# Altium schematic sheet Sensors.SchDoc
size 420 x 297 mm; SheetNumber: 3; SheetTotal: 4
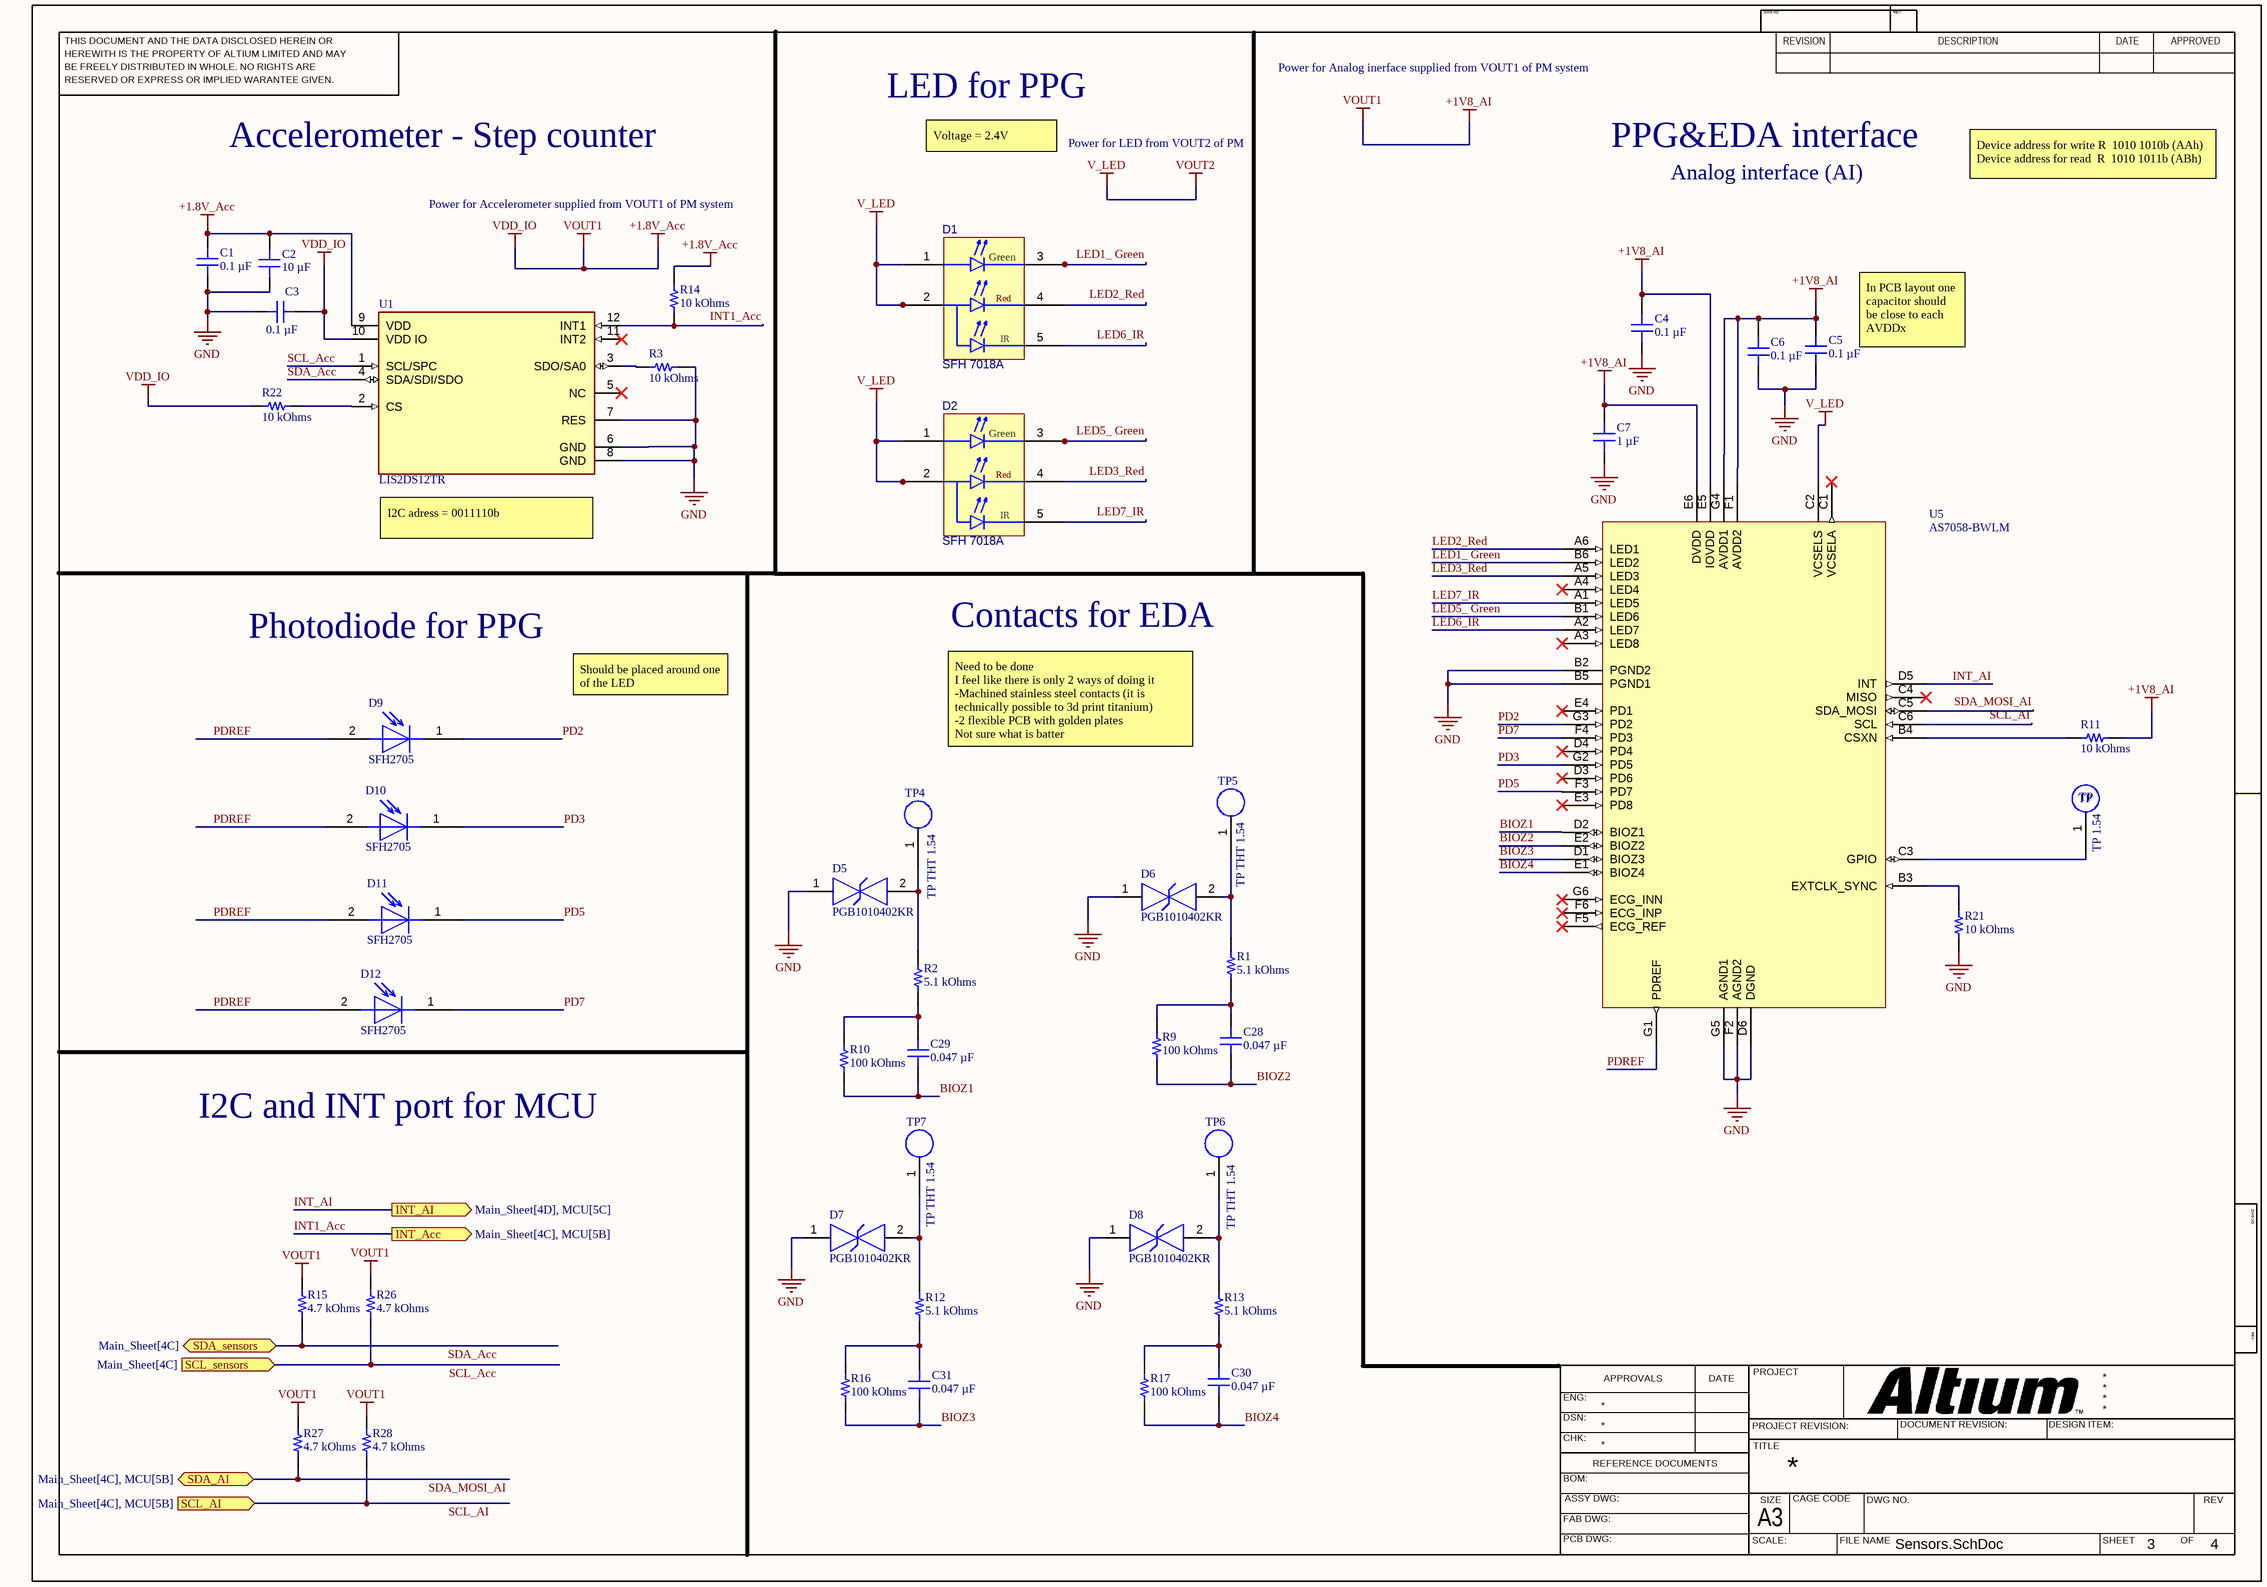
[diagram p0: Sensors.SchDoc]

## Parts
C1  0.1 µF  [CAP 0402_1005]
C2  10 µF  [CAP 0402_1005]
C3  0.1 µF  [CAP 0402_1005]
C4  0.1 µF  [CAP 0402_1005]
C5  0.1 µF  [CAP 0402_1005]
C6  0.1 µF  [CAP 0402_1005]
C7  1 µF  [CAP 0402_1005]
C28  0.047 µF  [CAP 0402_1005]
C29  0.047 µF  [CAP 0402_1005]
C30  0.047 µF  [CAP 0402_1005]
C31  0.047 µF  [CAP 0402_1005]
D1  SFH 7018A  [SFH 7018A-Footprint-1]
D2  SFH 7018A  [SFH 7018A-Footprint-1]
D5  PGB1010402KR  [FP-PGB1-0402-MFG]
D6  PGB1010402KR  [FP-PGB1-0402-MFG]
D7  PGB1010402KR  [FP-PGB1-0402-MFG]
D8  PGB1010402KR  [FP-PGB1-0402-MFG]
D9  SFH2705  [DFN175P215X60-2N]
D10  SFH2705  [DFN175P215X60-2N]
D11  SFH2705  [DFN175P215X60-2N]
D12  SFH2705  [DFN175P215X60-2N]
R1  5.1 kOhms  [RES 0402_1005]
R2  5.1 kOhms  [RES 0402_1005]
R3  10 kOhms  [RES 0402_1005]
R9  100 kOhms  [YAGEO RES 0402_1005]
R10  100 kOhms  [YAGEO RES 0402_1005]
R11  10 kOhms  [RES 0402_1005]
R12  5.1 kOhms  [RES 0402_1005]
R13  5.1 kOhms  [RES 0402_1005]
R14  10 kOhms  [RES 0402_1005]
R15  4.7 kOhms  [YAGEO RES 0402_1005]
R16  100 kOhms  [YAGEO RES 0402_1005]
R17  100 kOhms  [YAGEO RES 0402_1005]
R21  10 kOhms  [RES 0402_1005]
R22  10 kOhms  [RES 0402_1005]
R26  4.7 kOhms  [YAGEO RES 0402_1005]
R27  4.7 kOhms  [YAGEO RES 0402_1005]
R28  4.7 kOhms  [YAGEO RES 0402_1005]
TP  TP 1.54  [TP-Footprint-1]  (no BOM)
TP4  TP THT 1.54  [TP-Footprint-1]  (no BOM)
TP5  TP THT 1.54  [TP-Footprint-1]  (no BOM)
TP6  TP THT 1.54  [TP-Footprint-1]  (no BOM)
TP7  TP THT 1.54  [TP-Footprint-1]  (no BOM)
U1  LIS2DS12TR  [FP-LGA12_8566956-MFG]
U5  AS7058-BWLM  [BGA42C40P6X7_254X282X60]

## Ports
INT_Acc (out, see Main_Sheet[4C], MCU[5B]), INT_AI (out, see Main_Sheet[4D], MCU[5C]), SCL_AI (in, see Main_Sheet[4C], MCU[5B]), SCL_sensors (in, see Main_Sheet[4C]), SDA_AI (bidir, see Main_Sheet[4C], MCU[5B]), SDA_sensors (bidir, see Main_Sheet[4C])

## Nets
+1.8V_Acc: C1.2 C2.2 C3.1 C4.2 C5.2 C6.2 C7.2 R11.2 R14.2 R15.2 R22.1 R26.2 R27.2 R28.2 U1.9(VDD) U1.10(VDD_IO) U5.E5(IOVDD) U5.E6(DVDD) U5.F1(AVDD2) U5.G4(AVDD1)  [also labelled +1V8_AI, VDD_IO, VOUT1]
GND: C1.1 C2.1 C3.2 C4.1 C5.1 C6.1 C7.1 D5.1 D6.1 D7.1 D8.1 R3.2 R21.1 U1.6(GND) U1.7(RES) U1.8(GND) U5.B2(PGND2) U5.B5(PGND1) U5.D6(DGND) U5.F2(AGND2) U5.G5(AGND1)
V_LED: D1.1 D1.2 D1.6 D2.1 D2.2 D2.6 U5.C2(VCSELS)  [also labelled VOUT2]
BIOZ1: C29.1 R10.1 U5.D2(BIOZ1)
BIOZ2: C28.1 R9.1 U5.E2(BIOZ2)
BIOZ3: C31.1 R16.1 U5.D1(BIOZ3)
BIOZ4: C30.1 R17.1 U5.E1(BIOZ4)
INT1_Acc: R14.1 U1.12(INT1) ; port INT_Acc
INT_AI: U5.D5(INT) ; port INT_AI
LED1_ Green: D1.3 D1.7 D1.8 U5.B6(LED2)
LED2_Red: D1.4 U5.A6(LED1)
LED3_Red: D2.4 U5.A5(LED3)
LED5_ Green: D2.3 D2.7 D2.8 U5.B1(LED6)
LED6_IR: D1.5 U5.A2(LED7)
LED7_IR: D2.5 U5.A1(LED5)
PD2: D9.1 U5.G3(PD2)
PD3: D10.1 U5.G2(PD5)
PD5: D11.1 U5.F3(PD7)
PD7: D12.1 U5.F4(PD3)
PDREF: D9.2 D10.2 D11.2 D12.2 U5.G1(PDREF)
SCL_Acc: R26.1 U1.1(SCL/SPC) ; port SCL_sensors
SCL_AI: R28.1 U5.C6(SCL) ; port SCL_AI
SDA_Acc: R15.1 U1.4(SDA/SDI/SDO) ; port SDA_sensors
SDA_MOSI_AI: R27.1 U5.C5(SDA_MOSI) ; port SDA_AI
NetC28_2: C28.2 R1.1 R9.2
NetC29_2: C29.2 R2.1 R10.2
NetC30_2: C30.2 R13.1 R17.2
NetC31_2: C31.2 R12.1 R16.2
NetD5_2: D5.2 R2.2 TP4.1
NetD6_2: D6.2 R1.2 TP5.1
NetD7_2: D7.2 R12.2 TP7.1
NetD8_2: D8.2 R13.2 TP6.1
NetR3_1: R3.1 U1.3(SDO/SA0)
NetR11_1: R11.1 U5.B4(CSXN)
NetR21_2: R21.2 U5.B3(EXTCLK_SYNC)
NetR22_2: R22.2 U1.2(CS)
NetTP_1: TP.1 U5.C3(GPIO)

Not connected (* = marked no-connect by the designer): U1 5(NC)* 11(INT2)*; U5 A3(LED8)* A4(LED4)* C1(VCSELA)* C4(MISO)* D3(PD6)* D4(PD4)* E3(PD8)* E4(PD1)* F5(ECG_REF)* F6(ECG_INP)* G6(ECG_INN)*

## Notes on the sheet
- LED for PPG
- Power for Analog inerface supplied from VOUT1 of PM system
- Accelerometer - Step counter
- Voltage = 2.4V
- Power for LED from VOUT2 of PM
- PPG&EDA interface
- Analog interface (AI)
- Device address for write R  1010 1010b (AAh)
  Device address for read  R  1010 1011b (ABh)
- Power for Accelerometer supplied from VOUT1 of PM system
- (near C5) In PCB layout one capacitor should be close to each AVDDx
- (near U1) I2C adress = 0011110b
- Photodiode for PPG
- Contacts for EDA
- Should be placed around one of the LED
- Need to be done
  I feel like there is only 2 ways of doing it
  -Machined stainless steel contacts (it is technically possible to 3d print titanium)
  -2 flexible PCB with golden plates
  Not sure what is batter
- I2C and INT port for MCU
- THIS DOCUMENT AND THE DATA DISCLOSED HEREIN OR
- HEREWITH IS THE PROPERTY OF ALTIUM LIMITED AND MAY
- DWG NO:
- REVISION
- REV:
- DESCRIPTION
- DATE
- APPROVED
- BE FREELY DISTRIBUTED IN WHOLE. NO RIGHTS ARE
- RESERVED OR EXPRESS OR IMPLIED WARANTEE GIVEN.
- ENG:
- APPROVALS
- PROJECT
- DSN:
- CHK:
- REFERENCE DOCUMENTS
- PROJECT REVISION:
- TITLE
- DOCUMENT REVISION:
- DESIGN ITEM:
- BOM:
- FAB DWG:
- PCB DWG:
- ASSY DWG:
- SCALE:
- A3
- SIZE
- CAGE CODE
- FILE NAME
- DWG NO.
- SHEET
- OF
- REV
- (in symbol CMP-007-00036-4) Green; Red; IR

## Library data of the parts
C1 C3 C5 C6 = CL05B104KP5VPNC: CAP CER 100NF 10V X7R 0402; manufacturer: Samsung Electro-Mechanics; Tolerance: ±10%; Part Number: CL05B104KP5VPNC; Capacitance: 0.1 µF; Applications: Automotive; componentlink1description: Datasheet; componentlink1url: https://mm.digikey.com/Volume0/opasdata/d220001/medias/docus/5458/CL05B104KP5VPNC_Spec.pdf; componentlink2description: DigiKey Link; componentlink2url: https://www.digikey.com/en/products/detail/samsung-electro-mechanics/CL05B104KP5VPNC/20498482; Device Package: 0402 (1005 Metric); lastupdated: 2/9/2024 8:03:17 PM; Lifecycle Status: Active; Minimum Order: 1; Mounting Type: Surface Mount, MLCC; Operating Temperature: -55°C ~ 125°C; Package / Case: 0402 (1005 Metric); packaging: TapeAndReel; partid: 56690; price: 0.01; Ratings: AEC-Q200; series: CL; Size / Dimension: 0.039" L x 0.020" W (1.00mm x 0.50mm); Supplier 1: DigiKey; Supplier Part Number 1: 1276-CL05B104KP5VPNCCT-ND; Temperature Coefficient: X7R; Thickness (Max): 0.022" (0.55mm); value: 0.1 µF; Voltage - Rated: 10V
C2 = CL05A106MP8NUB8: CAP CER 10UF 10V X5R 0402; manufacturer: Samsung Electro-Mechanics; Tolerance: ±20%; Part Number: CL05A106MP8NUB8; Capacitance: 10 µF; Applications: Acoustic Noise Reduction; componentlink1description: Datasheet; componentlink1url: http://www.samsungsem.com/kr/support/product-search/mlcc/CL05A106MP8NUB8.jsp; componentlink2description: DigiKey Link; componentlink2url: https://www.digikey.com/en/products/detail/samsung-electro-mechanics/CL05A106MP8NUB8/5961314; Device Package: 0402 (1005 Metric); lastupdated: 2/9/2024 8:04:38 PM; Lifecycle Status: Active; Minimum Order: 1; Mounting Type: Surface Mount, MLCC; Operating Temperature: -55°C ~ 85°C; Package / Case: 0402 (1005 Metric); packaging: TapeAndReel; partid: 1758; Part Status: Active; price: 0.06; series: CL; Size / Dimension: 0.039" L x 0.020" W (1.00mm x 0.50mm); Supplier 1: DigiKey; Supplier Part Number 1: 1276-6830-1-ND; Temperature Coefficient: X5R; Thickness (Max): 0.035" (0.90mm); value: 10 µF; Voltage - Rated: 10V
C4 = CL05B104KP5VPNC: CAP CER 100NF 10V X7R 0402; manufacturer: Samsung Electro-Mechanics; Temperature Coefficient: X5R; Tolerance: ±10%; Part Number: CL05B104KP5VPNC; Capacitance: 0.1 µF; Applications: Automotive; componentlink1description: Datasheet; componentlink1url: https://mm.digikey.com/Volume0/opasdata/d220001/medias/docus/5458/CL05B104KP5VPNC_Spec.pdf; componentlink2description: DigiKey Link; componentlink2url: https://www.digikey.com/en/products/detail/samsung-electro-mechanics/CL05B104KP5VPNC/20498482; Device Package: 0402 (1005 Metric); lastupdated: 2/9/2024 8:03:17 PM; Lifecycle Status: Active; Minimum Order: 1; Mounting Type: Surface Mount, MLCC; Operating Temperature: -55°C ~ 125°C; Package / Case: 0402 (1005 Metric); packaging: TapeAndReel; partid: 56690; price: 0.01; Ratings: AEC-Q200; series: CL; Size / Dimension: 0.039" L x 0.020" W (1.00mm x 0.50mm); Supplier 1: DigiKey; Supplier Part Number 1: 1276-CL05B104KP5VPNCCT-ND; Thickness (Max): 0.022" (0.55mm); value: 0.1 µF; Voltage - Rated: 10V
C7 = 885012105012: CAP CER 1UF 10V X5R 0402; manufacturer: Würth Elektronik; Tolerance: ±20%; Part Number: 885012105012; Capacitance: 1 µF; Applications: General Purpose; componentlink1description: Datasheet; componentlink1url: https://katalog.we-online.de/pbs/datasheet/885012105012.pdf; componentlink2description: DigiKey Link; componentlink2url: https://www.digikey.com/en/products/detail/würth-elektronik/885012105012/5453344; Device Package: 0402 (1005 Metric); lastupdated: 2/9/2024 8:04:38 PM; Lifecycle Status: Active; Minimum Order: 1; Mounting Type: Surface Mount, MLCC; Operating Temperature: -55°C ~ 85°C; Package / Case: 0402 (1005 Metric); packaging: TapeAndReel; partid: 1807; Part Status: Active; price: 0.16; series: WCAP-CSGP; Size / Dimension: 0.039" L x 0.020" W (1.00mm x 0.50mm); Supplier 1: DigiKey; Supplier Part Number 1: 732-7489-1-ND; Temperature Coefficient: X5R; Thickness (Max): 0.022" (0.55mm); value: 1 µF; Voltage - Rated: 10V
C28-C31 = C0402C473K3REC7867: CAP CER 0402 47NF 25V X7R 10%; manufacturer: KEMET; Part Number: C0402C473K3REC7867; Capacitance: 0.047 µF; Applications: ESD Protection; componentlink1description: Datasheet; componentlink1url: https://api.kemet.com/component-edge/download/datasheet/C0402C473K3REC7867.pdf; componentlink2description: DigiKey Link; componentlink2url: https://www.digikey.com/en/products/detail/kemet/C0402C473K3REC7867/8643594; Device Package: 0402 (1005 Metric); lastupdated: 2/9/2024 8:04:15 PM; Lifecycle Status: Active; Minimum Order: 1; Mounting Type: Surface Mount, MLCC; Operating Temperature: -55°C ~ 125°C; Package / Case: 0402 (1005 Metric); packaging: TapeAndReel; partid: 33555; Part Status: Active; price: 0.01; series: ESD SMD Comm X7R; Size / Dimension: 0.039" L x 0.020" W (1.00mm x 0.50mm); Supplier 1: DigiKey; Supplier Part Number 1: 399-C0402C473K3REC7867CT-ND; Temperature Coefficient: X7R; Thickness (Max): 0.022" (0.55mm); Tolerance: ±10%; value: 0.047 µF; Voltage - Rated: 25V
D1 D2 = CMP-007-00036-4: Led, Hr/ir/tg, 655/940/532NM, 120DEG Rohs Compliant: Yes; pin to pad: 1>6 3>1 4>5 5>3 6>4; Colour: Green, Red, IR
D5-D8 = CMP-2000-05189-2: TVS DIODE 12V 250V 0402; Manufacturer: Littelfuse; Capacitance: 0.04pF; Direction: Bidirectional; Number Of Channels: 1; Value: 0.04pF; Automotive: No; Temperature: -65°C to +125°C; Category: Diode; Device Class L2: TVS Diodes; Temperature Range High: +125°C; Octopart: https://octopart.com/pgb1010402kr-littelfuse-10444990; Temperature Range Low: -65°C; Digikey Description: TVS DIODE 12V 250V 0402; RoHS: TRUE; Lead Free: Yes; Ipc Land Pattern Name: DIOC9951X31; ComponentLink2URL: https://www.littelfuse.com/~/media/electronics/datasheets/pulseguard_esd_suppressors/littelfuse_pulseguard_pgb1_datasheet.pdf.pdf; Manufacturer Part Number: PGB1010402KR; Device Class L1: Circuit Protection; Package: PGB1-0402; Mouser Description: ESD Suppressors / TVS Diodes PULSEGUARD 0402 ESD SUPPRESSOR; Clamping Voltage: 250V; Device Class L3: unset; Height: 0.39mm; ComponentLink2Description: Datasheet
D9-D12 = CMP-00026-00001-2: Photodiode with wide range of wavelength
R1 R2 R12 R13 = ERJ-PA2F5101X: RES 5.1K OHM 1% 1/4W 0402; Manufacturer: Panasonic Electronic Components; Power (Watts): 0.25W, 1/4W; Temperature Coefficient: ±100ppm/°C; Part Number: ERJ-PA2F5101X; Value: 5.1 kOhms; ComponentLink1Description: Datasheet; ComponentLink1URL: https://industrial.panasonic.com/cdbs/www-data/pdf/RDO0000/AOA0000C331.pdf; ComponentLink2Description: DigiKey Link; ComponentLink2URL: https://www.digikey.com/en/products/detail/panasonic-electronic-components/ERJ-PA2F5101X/9815254; Composition: Thick Film; Device Package: 0402 (1005 Metric); Features: Automotive AEC-Q200, Pulse Withstanding; Height - Seated (Max): 0.016" (0.40mm); LastUpdated: 2/9/2024 8:30:01 PM; Lifecycle Status: Active; Minimum Order: 1; Number of Terminations: 2; Operating Temperature: -55°C ~ 155°C; Package / Case: 0402 (1005 Metric); Packaging: TapeAndReel; PartId: 8439; Part Status: Active; Price: 0.02; Ratings: AEC-Q200; Resistance: 5.1 kOhms; Series: ERJ-PA2; Size / Dimension: 0.039" L x 0.020" W (1.00mm x 0.50mm); Supplier 1: DigiKey; Supplier Part Number 1: P124488CT-ND; Supplier Device Package: 402; Tolerance: ±1%
R3 R11 R14 R22 = RP73PF1E10KBTD: RES 10K OHM 0.1% 1/10W 0402; Manufacturer: TE Connectivity Passive Product; Power (Watts): 0.1W, 1/10W; Temperature Coefficient: ±25ppm/°C; Tolerance: ±1%; Part Number: RP73PF1E10KBTD; Value: 10 kOhms; ComponentLink1Description: Datasheet; ComponentLink1URL: https://www.te.com/commerce/DocumentDelivery/DDEController?Action=srchrtrv&DocNm=1773272&DocType=DS&DocLang=English; ComponentLink2Description: DigiKey Link; ComponentLink2URL: https://www.digikey.com/en/products/detail/te-connectivity-passive-product/RP73PF1E10KBTD/8260957; Composition: Thin Film; Device Package: 0402 (1005 Metric); Height - Seated (Max): 0.014" (0.35mm); LastUpdated: 2/9/2024 8:30:24 PM; Lifecycle Status: Active; Minimum Order: 1; Number of Terminations: 2; Operating Temperature: -55°C ~ 155°C; Package / Case: 0402 (1005 Metric); Packaging: TapeAndReel; PartId: 2434; Part Status: Active; Price: 0.08; Resistance: 10 kOhms; Series: RP73, Holsworthy; Size / Dimension: 0.039" L x 0.020" W (1.00mm x 0.50mm); Supplier 1: DigiKey; Supplier Part Number 1: A127415CT-ND; Supplier Device Package: 0402
R9 R10 R16 R17 = SR0402FR-7T100KL: RES 100K OHM 1% 1/5W 0402; Manufacturer: Yageo; Power (Watts): 0.2W, 1/5W; Temperature Coefficient: ±100ppm/°C; Part Number: SR0402FR-7T100KL; Value: 100 kOhms; ComponentLink1Description: Datasheet; ComponentLink1URL: http://www.yageo.com/documents/recent/PYu-SR_D_F%20tol_RoHS_L_4.pdf; ComponentLink2Description: DigiKey Link; ComponentLink2URL: https://www.digikey.com/en/products/detail/yageo/SR0402FR-7T100KL/9373087; Composition: Thick Film; Device Package: 0402 (1005 Metric); Features: Automotive AEC-Q200, Pulse Withstanding; Height - Seated (Max): 0.016" (0.40mm); LastUpdated: 8/31/2025 3:04:17 PM; Lifecycle Status: Active; Minimum Order: 1; Number of Terminations: 2; Operating Temperature: -55°C ~ 155°C; Package / Case: 0402 (1005 Metric); Packaging: TapeAndReel; PartId: 4405; Part Status: Active; Price: 0.09; Ratings: AEC-Q200; Resistance: 100 kOhms; Series: SR; Size / Dimension: 0.039" L x 0.020" W (1.00mm x 0.50mm); Supplier 1: DigiKey; Supplier Part Number 1: YAG5813CT-ND; Supplier Device Package: 0402; Tolerance: ±1%
R15 R26-R28 = RT0402FRE074K7L: RES SMD 4.7K OHM 1% 1/16W 0402; Manufacturer: Yageo; Power (Watts): 0.063W, 1/16W; Temperature Coefficient: ±50ppm/°C; Part Number: RT0402FRE074K7L; Value: 4.7 kOhms; ComponentLink1Description: Datasheet; ComponentLink1URL: https://www.yageo.com/upload/media/product/productsearch/datasheet/rchip/PYu-RT_1-to-0.01_RoHS_L_11.pdf; ComponentLink2Description: DigiKey Link; ComponentLink2URL: https://www.digikey.com/en/products/detail/yageo/RT0402FRE074K7L/1072052; Composition: Thin Film; Device Package: 0402 (1005 Metric); Height - Seated (Max): 0.014" (0.35mm); LastUpdated: 8/31/2025 3:04:17 PM; Lifecycle Status: Active; Minimum Order: 1; Number of Terminations: 2; Operating Temperature: -55°C ~ 155°C; Package / Case: 0402 (1005 Metric); Packaging: TapeAndReel; PartId: 3198; Part Status: Active; Price: 0.01; Resistance: 4.7 kOhms; Series: RT; Size / Dimension: 0.039" L x 0.020" W (1.00mm x 0.50mm); Supplier 1: DigiKey; Supplier Part Number 1: YAG3347CT-ND; Supplier Device Package: 0402; Tolerance: ±1%
R21 = RP73PF1E10KBTD: RES 10K OHM 0.1% 1/10W 0402; Manufacturer: TE Connectivity Passive Product; Power (Watts): 0.1W, 1/10W; Temperature Coefficient: ±25ppm/°C; Part Number: RP73PF1E10KBTD; Value: 10 kOhms; ComponentLink1Description: Datasheet; ComponentLink1URL: https://www.te.com/commerce/DocumentDelivery/DDEController?Action=srchrtrv&DocNm=1773272&DocType=DS&DocLang=English; ComponentLink2Description: DigiKey Link; ComponentLink2URL: https://www.digikey.com/en/products/detail/te-connectivity-passive-product/RP73PF1E10KBTD/8260957; Composition: Thin Film; Device Package: 0402 (1005 Metric); Height - Seated (Max): 0.014" (0.35mm); LastUpdated: 2/9/2024 8:30:24 PM; Lifecycle Status: Active; Minimum Order: 1; Number of Terminations: 2; Operating Temperature: -55°C ~ 155°C; Package / Case: 0402 (1005 Metric); Packaging: TapeAndReel; PartId: 2434; Part Status: Active; Price: 0.08; Resistance: 10 kOhms; Series: RP73, Holsworthy; Size / Dimension: 0.039" L x 0.020" W (1.00mm x 0.50mm); Supplier 1: DigiKey; Supplier Part Number 1: A127415CT-ND; Supplier Device Package: 0402; Tolerance: ±0.1%
TP = TestPoint-1: Rounded rectangular pad 1.54mm
TP4-TP7 = CMP-00001-1: Test pint THT round via 1.54mm pad 1mm hole
U1 = CMP-12175-000010-1: ACCEL 2-16G I2C/SPI 12LGA; Operating Supply Voltage: 1.98V; Bandwidth: 6.25Hz; Axis: X, Y, Z; Output Type: SPI; Case/Package: LGA; Min Operating Temperature: -40°C; Lead Free: Lead Free; Mount: Surface Mount; Max Operating Temperature: 85°C; Contact Plating: Gold; Number of Pins: 12; Packaging: Tape and Reel
U5 = CMP-015-00012-3: AS7058 Series 1.8 V PPG/ECG/BioZ/EDA Vital Sign Monitoring IC - WLCSP-42